# EAGLE design harp RBG array v1.0 (EAGLE 6.5.0)

## Sheet 1 of 3
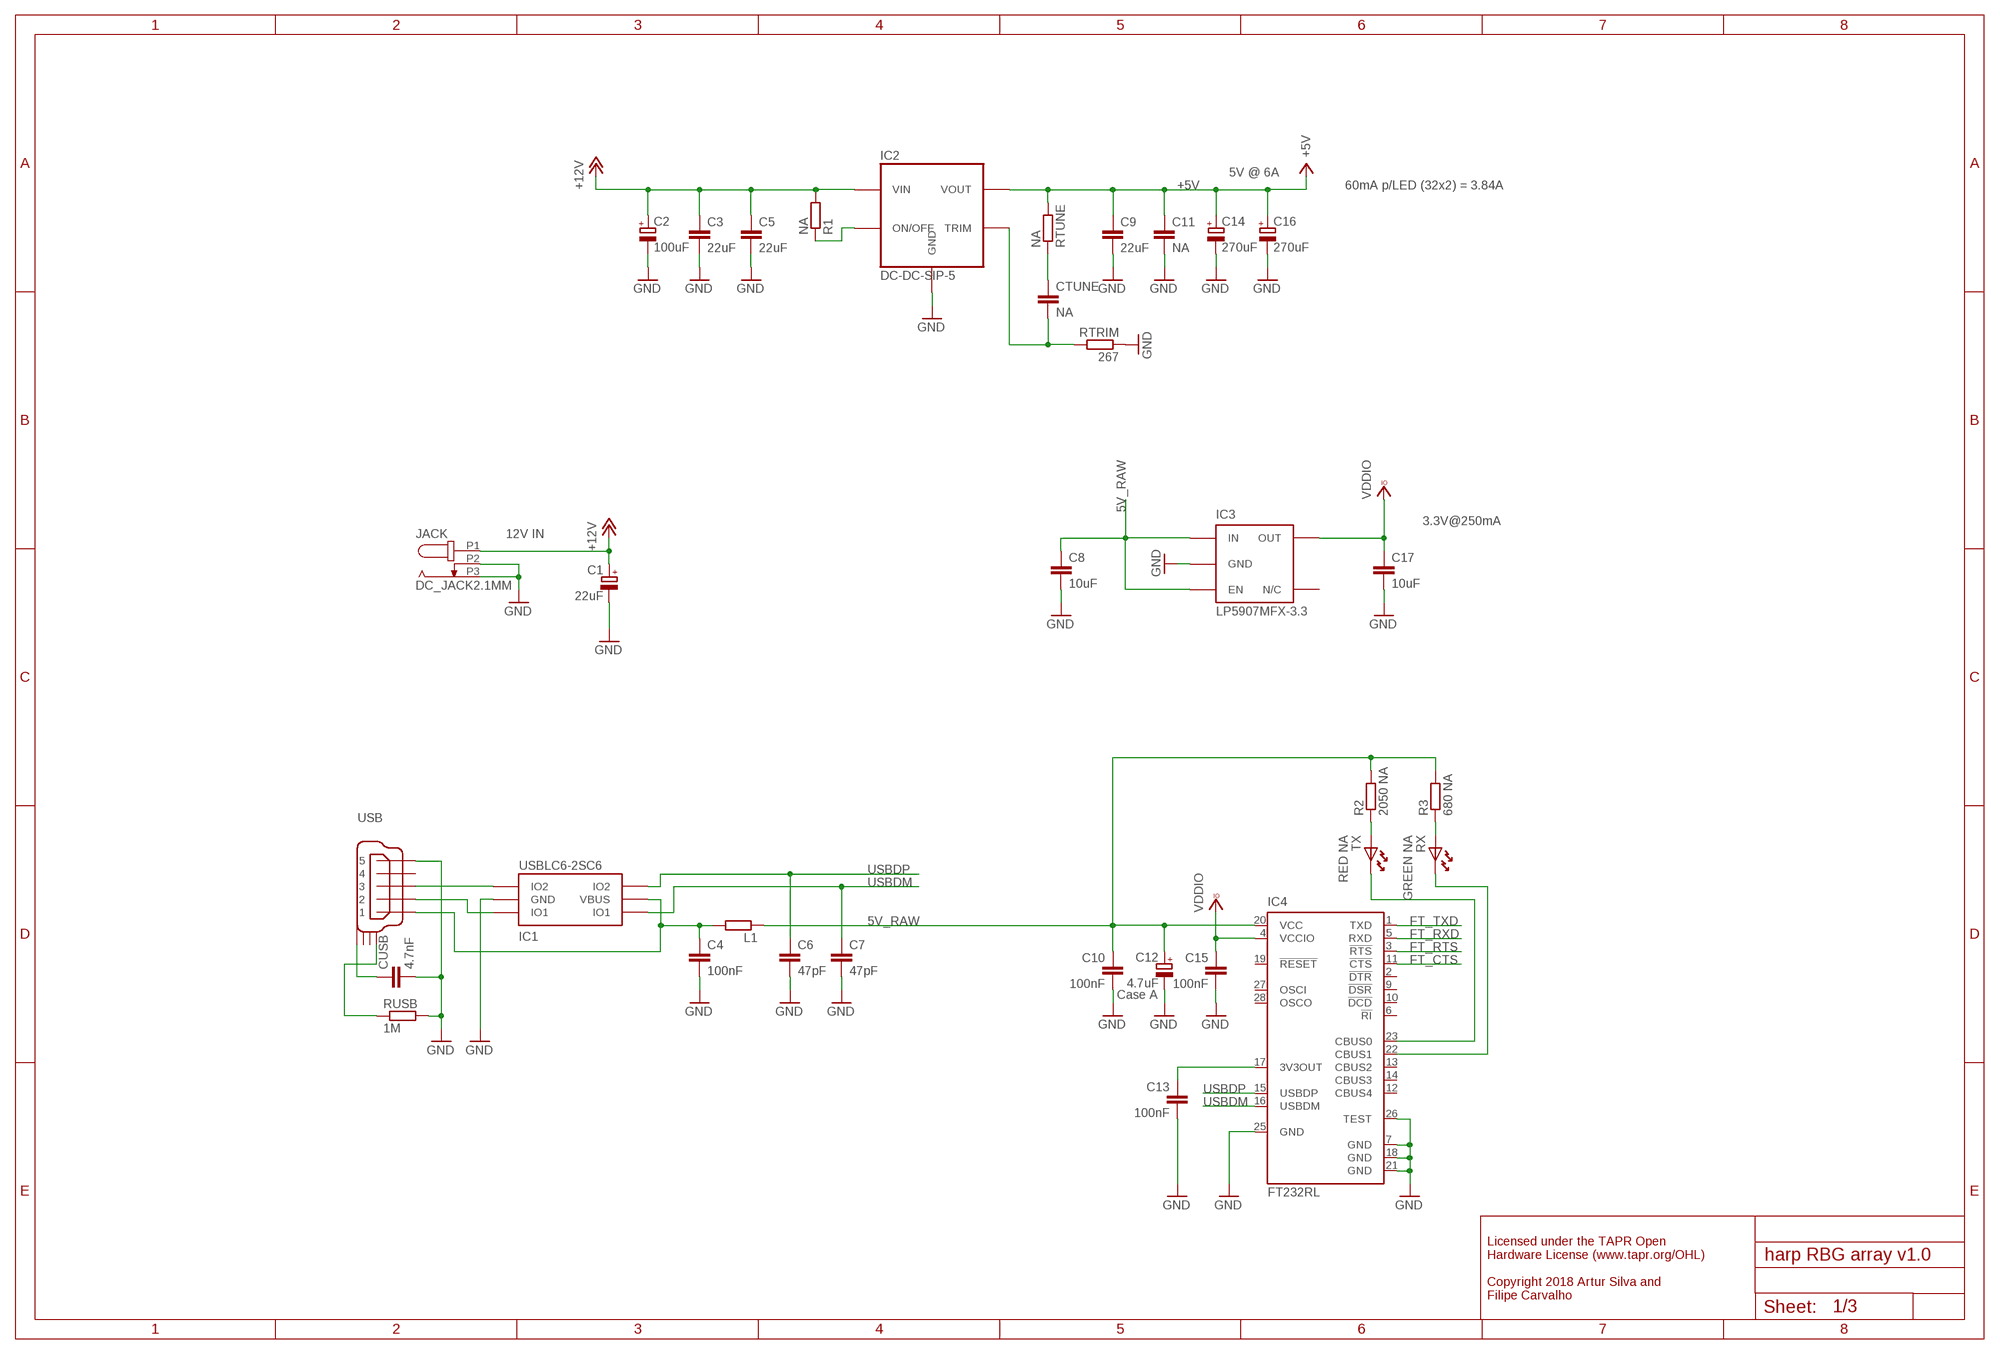
[diagram p0: schematic, sheet 1]

### Parts
C1  22uF  CAP_100UFHAND  [CAP_100UF_HAND]
C2  100uF  CPOL-EUE  [PANASONIC_E]
C3  22uF  C-EUC1210  [C1210]
C4  100nF  C-EUC0402  [C0402]
C5  22uF  C-EUC1210  [C1210]
C6  47pF  C-EUC0402  [C0402]
C7  47pF  C-EUC0402  [C0402]
C8  10uF  C-EUC0603  [C0603]
C9  22uF  C-EUC1210  [C1210]
C10  100nF  C-EUC0402  [C0402]
C11  NA  C-EUC1210  [C1210]
C12  4.7uF  CPOL-EUA/3216-18W  [A/3216-18W]
C13  100nF  C-EUC0402  [C0402]
C14  270uF  CPOL-EUE  [PANASONIC_E]
C15  100nF  C-EUC0402  [C0402]
C16  270uF  CPOL-EUE  [PANASONIC_E]
C17  10uF  C-EUC0603  [C0603]
CTUNE  NA  C-EUC0402  [C0402]
CUSB  4.7nF  C-EUC0402  [C0402]
IC1  USBLC6-2SC6  USBLC6-2  [SOT23-6L]
IC2  DC-DC-SIP-5  [SIP-5]
IC3  LP5907MFX-3.3  TLV700XX  [TSOT23-5]
IC4  FT232RL  [SSOP28]
JACK  DC_JACK2.1MM  [DC_POWER_INPUT_2.1MM]
L1  ???  R-EU_R0805  [R0805]
R1  NA  R-EU_R0402  [R0402]
R2  2050 NA  R-EU_R0402  [R0402]
R3  680 NA  R-EU_R0402  [R0402]
RTRIM  267  R-EU_R0402  [R0402]
RTUNE  NA  R-EU_R0402  [R0402]
RUSB  1M  R-EU_R0402  [R0402]
RX  GREEN NA  LEDHAND  [LED_HAND]
TX  RED NA  LEDHAND  [LED_HAND]
USB  USB_MINI_B  [240-0002-1]

### Nets
5V_RAW: C8.1 C10.1 C12.+ IC3.1(IN) IC3.3(EN) IC4.20(VCC) L1.1 R2.2 R3.2
+5V: C9.1 C11.1 C14.+ C16.+ IC2.P4(VOUT) RTUNE.2 ; also sheet 2,3
+12V: C1.+ C2.+ C3.1 C5.1 IC2.P2(VIN) JACK.P1 R1.2
FT_CTS: IC4.11(!CTS) ; also sheet 2
FT_RTS: IC4.3(!RTS) ; also sheet 2
FT_RXD: IC4.5(RXD) ; also sheet 2
FT_TXD: IC4.1(TXD) ; also sheet 2
GND: C1.- C2.- C3.2 C4.2 C5.2 C6.2 C7.2 C8.2 C9.2 C10.2 C11.2 C12.- C13.2 C14.- C15.2 C16.- C17.2 CUSB.2 IC1.P$2(GND) IC2.P3(GND) IC3.2(GND) IC4.7(GND) IC4.18(GND) IC4.21(GND) IC4.25(GND) IC4.26(TEST) JACK.P2 JACK.P3 RTRIM.1 RUSB.2 USB.P$5 ; also sheet 2,3
N$12: CTUNE.2 IC2.P5(TRIM) RTRIM.2
N$14: CTUNE.1 RTUNE.1
N$16: IC2.P1(ON/OFF) R1.1
N$38: C13.1 IC4.17(3V3OUT)
N$39: C4.1 IC1.P$5(VBUS) L1.2 USB.P$1
N$40: IC1.P$1(IO1) USB.P$2
N$47: R3.1 RX.A
N$48: IC4.23(CBUS0) TX.K
N$49: IC4.22(CBUS1) RX.K
N$50: IC1.P$3(IO2) USB.P$3
N$59: CUSB.1 USB.SHIELD_4
N$61: RUSB.1 USB.SHIELD_1
N$62: R2.1 TX.A
USBDM: C7.1 IC1.P$6(IO1) IC4.16(USBDM)
USBDP: C6.1 IC1.P$4(IO2) IC4.15(USBDP)
VCCIO: C15.1 C17.1 IC3.5(OUT) IC4.4(VCCIO) ; supply symbol labelled VDDIO ; also sheet 2,3
Unconnected: IC3.4(N/C) IC4.2(!DTR) IC4.6(!RI) IC4.9(!DSR) IC4.10(!DCD) IC4.12(CBUS4) IC4.13(CBUS2) IC4.14(CBUS3) IC4.19(!RESET) IC4.27(OSCI) IC4.28(OSCO) USB.P$4 USB.SHIELD_2 USB.SHIELD_3

### Notes on the sheet
- 5V @ 6A
- 60mA p/LED (32x2) = 3.84A
- 3.3V@250mA
- 12V IN
- Case A
- Licensed under the TAPR Open
  Hardware License (www.tapr.org/OHL)
  
  Copyright 2018 Artur Silva and 
  Filipe Carvalho

## Sheet 2 of 3
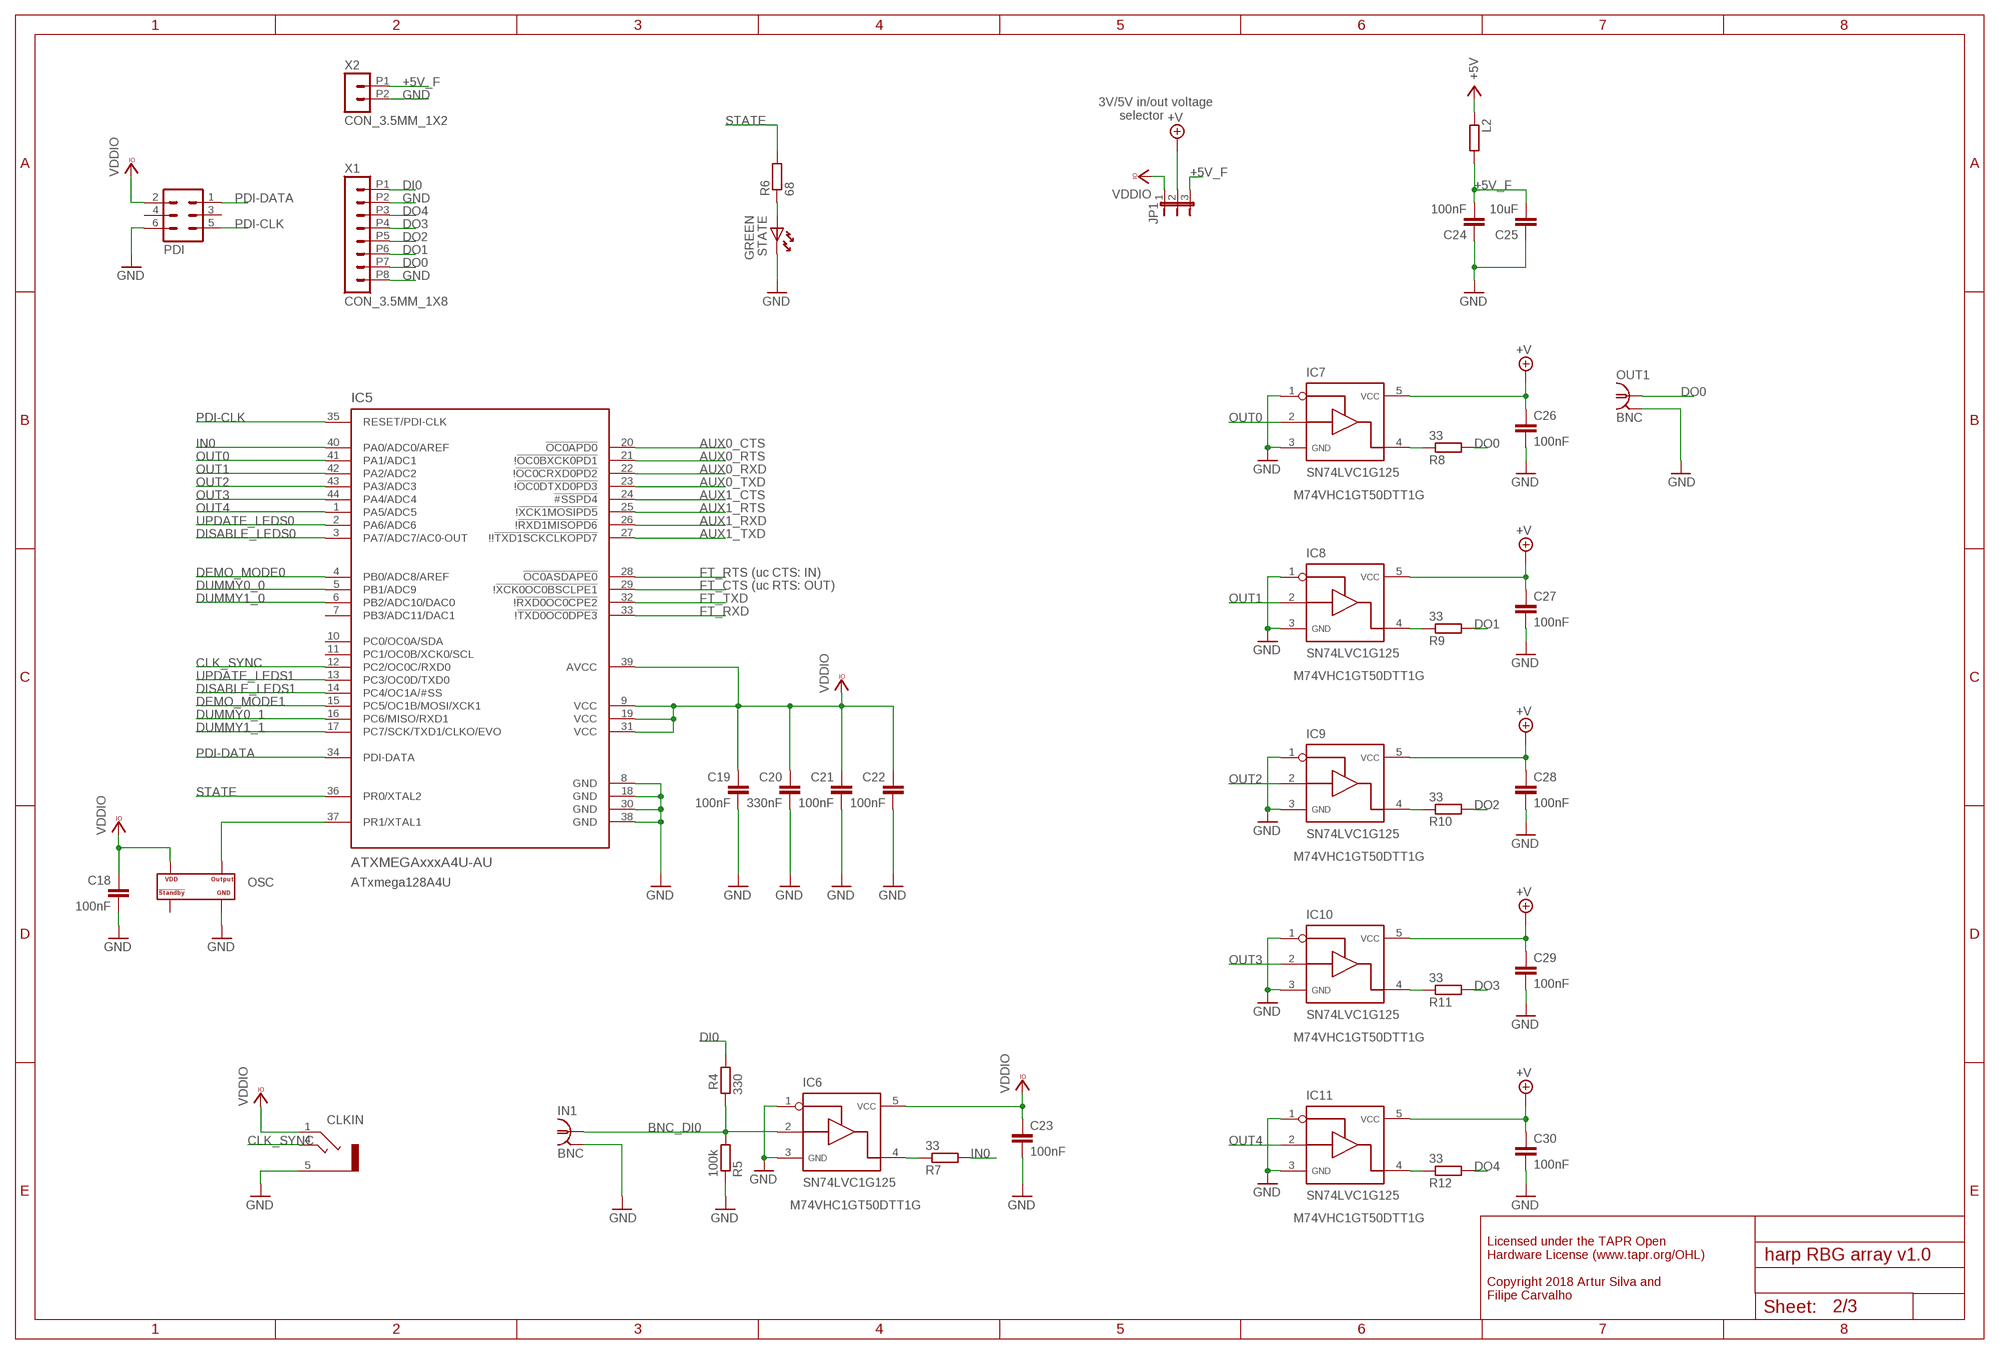
[diagram p1: schematic, sheet 2]

### Parts
C18  100nF  C-EUC0402  [C0402]
C19  100nF  C-EUC0402  [C0402]
C20  330nF  C-EUC0402  [C0402]
C21  100nF  C-EUC0402  [C0402]
C22  100nF  C-EUC0402  [C0402]
C23  100nF  C-EUC0402  [C0402]
C24  100nF  C-EUC0402  [C0402]
C25  10uF  C-EUC0603  [C0603]
C26  100nF  C-EUC0402  [C0402]
C27  100nF  C-EUC0402  [C0402]
C28  100nF  C-EUC0402  [C0402]
C29  100nF  C-EUC0402  [C0402]
C30  100nF  C-EUC0402  [C0402]
CLKIN  STEREO_JACK  [35RASMT2BHNTRX]
IC5  ATXMEGAxxxA4U-AU  AT-XMEGA-XXA4-AU  [QFP80P1200X1200X120-44N]
IC6  SN74LVC1G125  [SOT23-5]
IC7  SN74LVC1G125  [SOT23-5]
IC8  SN74LVC1G125  [SOT23-5]
IC9  SN74LVC1G125  [SOT23-5]
IC10  SN74LVC1G125  [SOT23-5]
IC11  SN74LVC1G125  [SOT23-5]
IN1  BNC  [BNC_RA]
JP1  JP2E  [JP2]
L2  600@100M  R-EU_R0805  [R0805]
OSC  OSCILLATOR  [OSCILLATOR_3.2X2.5]
OUT1  BNC  [BNC_RA]
PDI  MA03-2  [MA03-2]
R4  330  R-EU_R0402  [R0402]
R5  100k  R-EU_R0402  [R0402]
R6  68  R-EU_R0402  [R0402]
R7  33  R-EU_R0402  [R0402]
R8  33  R-EU_R0402  [R0402]
R9  33  R-EU_R0402  [R0402]
R10  33  R-EU_R0402  [R0402]
R11  33  R-EU_R0402  [R0402]
R12  33  R-EU_R0402  [R0402]
STATE  GREEN  LEDHAND  [LED_HAND]
X1  CON_3.5MM_1X8  [CON_3.5MM_1X8]
X2  CON_3.5MM_1X2  [CON_3.5MM_1X2]

### Nets
+5V: L2.1 ; also sheet 1,3
+5V_F: C24.2 C25.2 JP1.3 L2.2 X2.P1
+V: C26.1 C27.1 C28.1 C29.1 C30.1 IC7.5 IC8.5 IC9.5 IC10.5 IC11.5 JP1.2
AUX0_CTS: IC5.20(!OC0APD0) ; also sheet 3
AUX0_RTS: IC5.21(!!OC0BXCK0PD1) ; also sheet 3
AUX0_RXD: IC5.22(!!OC0CRXD0PD2) ; also sheet 3
AUX0_TXD: IC5.23(!!OC0DTXD0PD3) ; also sheet 3
AUX1_CTS: IC5.24(!#SSPD4) ; also sheet 3
AUX1_RTS: IC5.25(!!XCK1MOSIPD5) ; also sheet 3
AUX1_RXD: IC5.26(!!RXD1MISOPD6) ; also sheet 3
AUX1_TXD: IC5.27(!!!TXD1SCKCLKOPD7) ; also sheet 3
BNC_DI0: IC6.2 IN1.1 R4.2 R5.2
CLK_SYNC: CLKIN.4 IC5.12(PC2/OC0C/RXD0)
DEMO_MODE0: IC5.4(PB0/ADC8/AREF) ; also sheet 3
DEMO_MODE1: IC5.15(PC5/OC1B/MOSI/XCK1) ; also sheet 3
DI0: R4.1 X1.P1
DISABLE_LEDS0: IC5.3(PA7/ADC7/AC0-OUT) ; also sheet 3
DISABLE_LEDS1: IC5.14(PC4/OC1A/#SS) ; also sheet 3
DO0: OUT1.1 R8.2 X1.P7
DO1: R9.2 X1.P6
DO2: R10.2 X1.P5
DO3: R11.2 X1.P4
DO4: R12.2 X1.P3
DUMMY0_0: IC5.5(PB1/ADC9) ; also sheet 3
DUMMY0_1: IC5.16(PC6/MISO/RXD1) ; also sheet 3
DUMMY1_0: IC5.6(PB2/ADC10/DAC0) ; also sheet 3
DUMMY1_1: IC5.17(PC7/SCK/TXD1/CLKO/EVO) ; also sheet 3
FT_CTS: IC5.29(!!XCK0OC0BSCLPE1) ; also sheet 1
FT_RTS: IC5.28(!OC0ASDAPE0) ; also sheet 1
FT_RXD: IC5.33(!!TXD0OC0DPE3) ; also sheet 1
FT_TXD: IC5.32(!!RXD0OC0CPE2) ; also sheet 1
GND: C18.2 C19.2 C20.2 C21.2 C22.2 C23.2 C24.1 C25.1 C26.2 C27.2 C28.2 C29.2 C30.2 CLKIN.5 IC5.8(GND) IC5.18(GND) IC5.30(GND) IC5.38(GND) IC6.1 IC6.3 IC7.1 IC7.3 IC8.1 IC8.3 IC9.1 IC9.3 IC10.1 IC10.3 IC11.1 IC11.3 IN1.2 OSC.P$2(GND) OUT1.2 PDI.6 R5.1 STATE.K X1.P2 X1.P8 X2.P2 ; also sheet 1,3
IN0: IC5.40(PA0/ADC0/AREF) R7.2
N$2: IC6.4 R7.1
N$3: IC8.4 R9.1
N$4: IC7.4 R8.1
N$5: IC9.4 R10.1
N$6: IC10.4 R11.1
N$7: IC11.4 R12.1
N$23: R6.1 STATE.A
OSC2: IC5.37(PR1/XTAL1) OSC.P$3(OUTPUT)
OUT0: IC5.41(PA1/ADC1) IC7.2
OUT1: IC5.42(PA2/ADC2) IC8.2
OUT2: IC5.43(PA3/ADC3) IC9.2
OUT3: IC5.44(PA4/ADC4) IC10.2
OUT4: IC5.1(PA5/ADC5) IC11.2
PDI-CLK: IC5.35(RESET/PDI-CLK) PDI.5
PDI-DATA: IC5.34(PDI-DATA) PDI.1
STATE: IC5.36(PR0/XTAL2) R6.2
UPDATE_LEDS0: IC5.2(PA6/ADC6) ; also sheet 3
UPDATE_LEDS1: IC5.13(PC3/OC0D/TXD0) ; also sheet 3
VCCIO: C18.1 C19.1 C20.1 C21.1 C22.1 C23.1 CLKIN.1 IC5.9(VCC) IC5.19(VCC) IC5.31(VCC) IC5.39(AVCC) IC6.5 JP1.1 OSC.P$4(VDD) PDI.2 ; supply symbol labelled VDDIO ; also sheet 1,3
Unconnected: IC5.7(PB3/ADC11/DAC1) IC5.10(PC0/OC0A/SDA) IC5.11(PC1/OC0B/XCK0/SCL) OSC.P$1(STANDBY#) PDI.3 PDI.4

### Notes on the sheet
- 3V/5V in/out voltage
        selector
- M74VHC1GT50DTT1G
- (uc CTS: IN)
- (uc RTS: OUT)
- M74VHC1GT50DTT1G
- M74VHC1GT50DTT1G
- ATxmega128A4U
- M74VHC1GT50DTT1G
- M74VHC1GT50DTT1G
- M74VHC1GT50DTT1G
- Licensed under the TAPR Open
  Hardware License (www.tapr.org/OHL)
  
  Copyright 2018 Artur Silva and 
  Filipe Carvalho

## Sheet 3 of 3
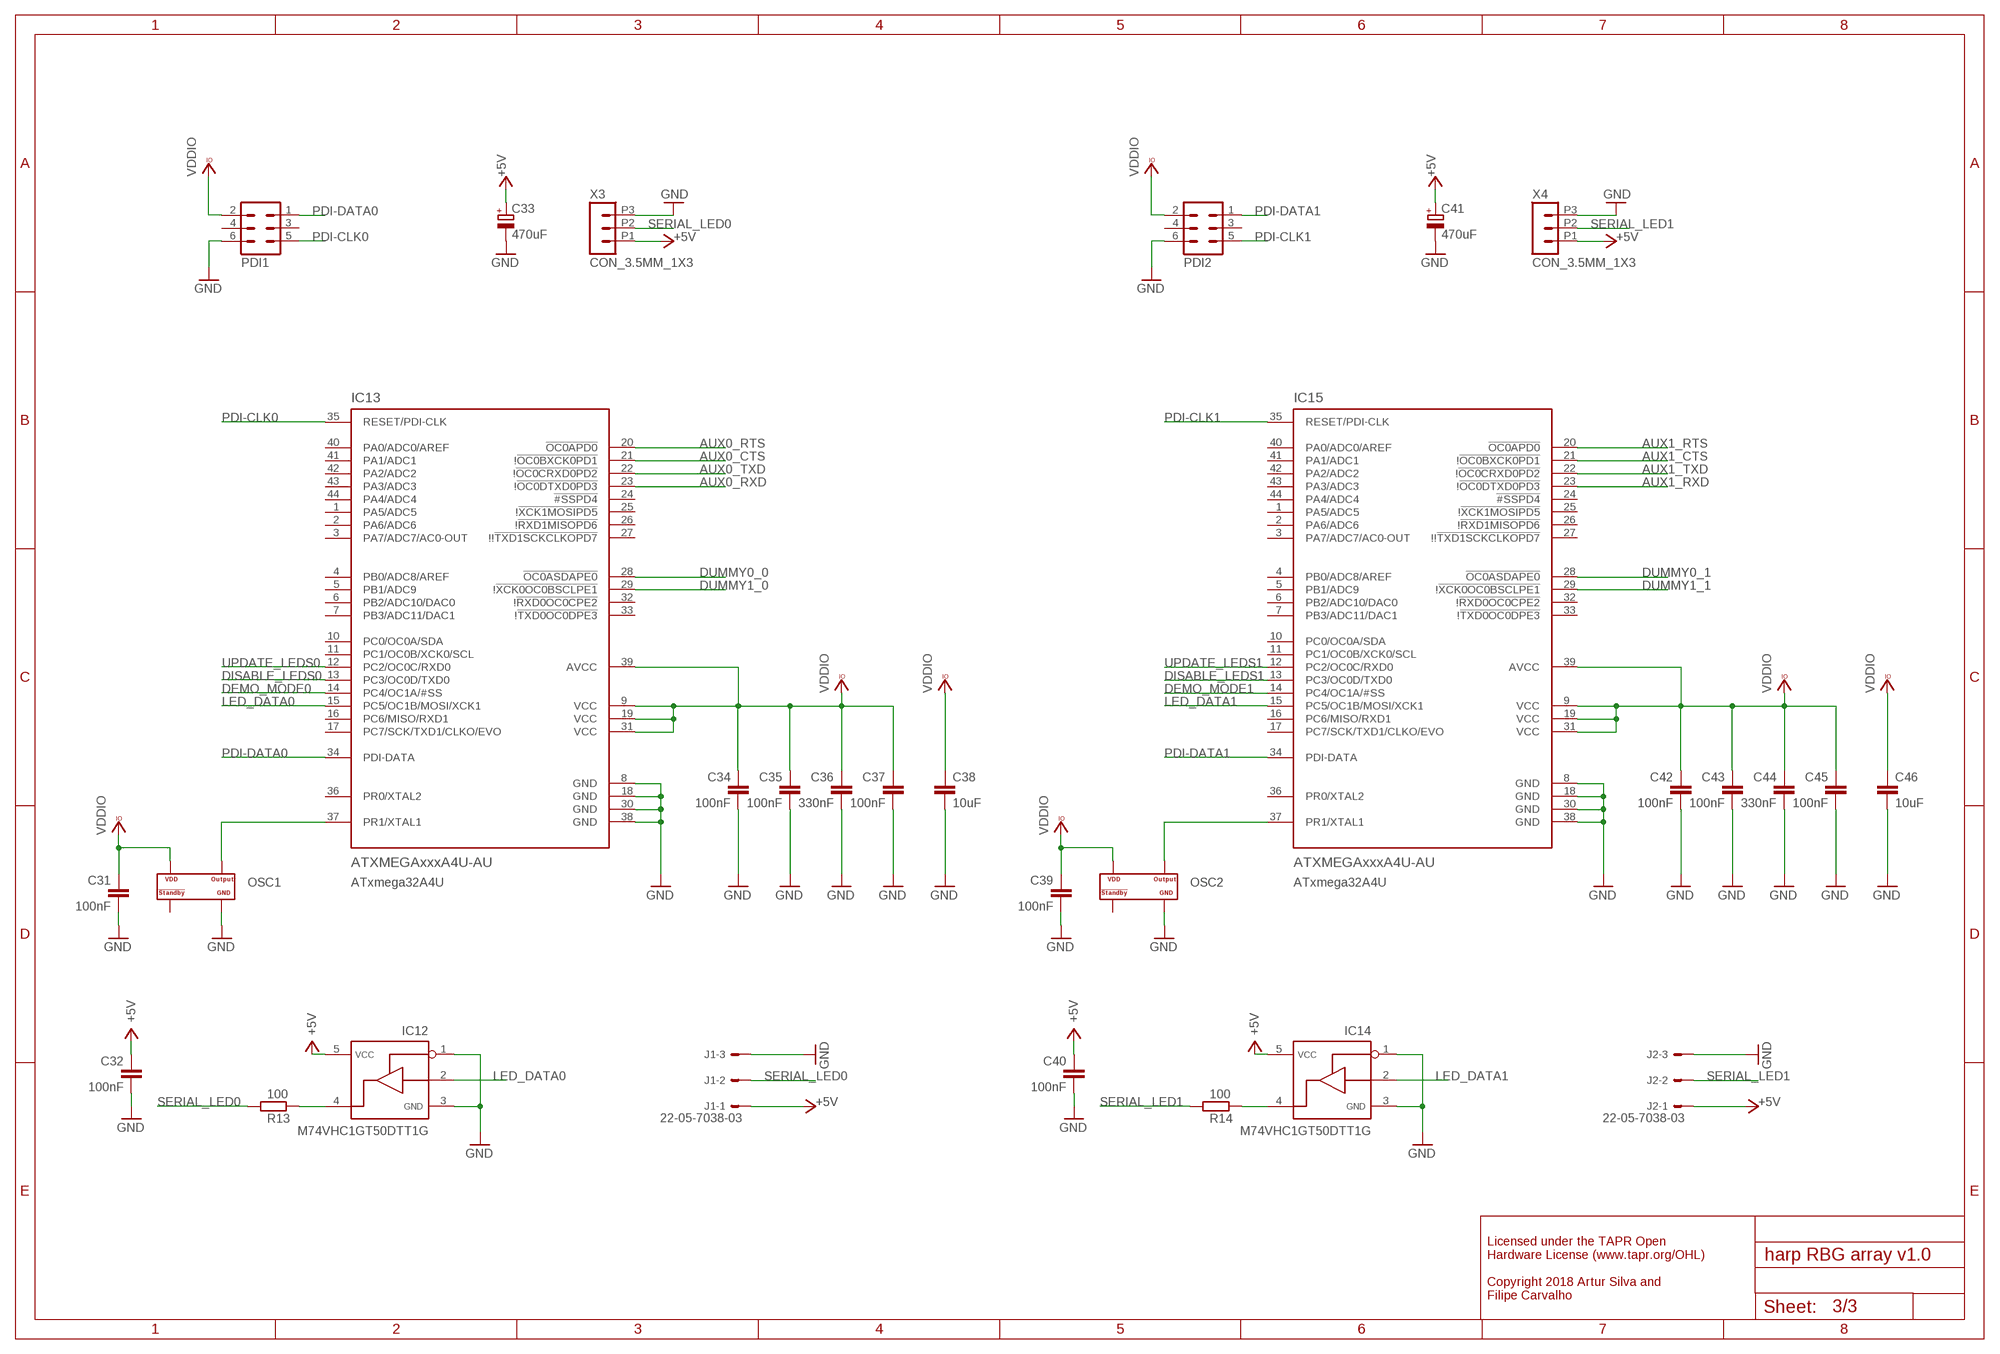
[diagram p2: schematic, sheet 3]

### Parts
C31  100nF  C-EUC0402  [C0402]
C32  100nF  C-EUC0402  [C0402]
C33  470uF  CPOL-EUE3.5-8  [E3,5-8]
C34  100nF  C-EUC0402  [C0402]
C35  100nF  C-EUC0402  [C0402]
C36  330nF  C-EUC0402  [C0402]
C37  100nF  C-EUC0402  [C0402]
C38  10uF  C-EUC0603  [C0603]
C39  100nF  C-EUC0402  [C0402]
C40  100nF  C-EUC0402  [C0402]
C41  470uF  CPOL-EUE3.5-8  [E3,5-8]
C42  100nF  C-EUC0402  [C0402]
C43  100nF  C-EUC0402  [C0402]
C44  330nF  C-EUC0402  [C0402]
C45  100nF  C-EUC0402  [C0402]
C46  10uF  C-EUC0603  [C0603]
IC12  M74VHC1GT50DTT1G  SN74LVC1G125  [SOT23-5]
IC13  ATXMEGAxxxA4U-AU  AT-XMEGA-XXA4-AU  [QFP80P1200X1200X120-44N]
IC14  M74VHC1GT50DTT1G  SN74LVC1G125  [SOT23-5]
IC15  ATXMEGAxxxA4U-AU  AT-XMEGA-XXA4-AU  [QFP80P1200X1200X120-44N]
J1  22-05-7038-03  [7395-03]
J2  22-05-7038-03  [7395-03]
OSC1  OSCILLATOR  [OSCILLATOR_3.2X2.5]
OSC2  OSCILLATOR  [OSCILLATOR_3.2X2.5]
PDI1  MA03-2  [MA03-2]
PDI2  MA03-2  [MA03-2]
R13  100  R-EU_R0402  [R0402]
R14  100  R-EU_R0402  [R0402]
X3  CON_3.5MM_1X3  [CON_3.5MM_1X3]
X4  CON_3.5MM_1X3  [CON_3.5MM_1X3]

### Nets
+5V: C32.1 C33.+ C40.1 C41.+ IC12.5 IC14.5 J1.1 J2.1 X3.P1 X4.P1 ; also sheet 1,2
AUX0_CTS: IC13.21(!!OC0BXCK0PD1) ; also sheet 2
AUX0_RTS: IC13.20(!OC0APD0) ; also sheet 2
AUX0_RXD: IC13.23(!!OC0DTXD0PD3) ; also sheet 2
AUX0_TXD: IC13.22(!!OC0CRXD0PD2) ; also sheet 2
AUX1_CTS: IC15.21(!!OC0BXCK0PD1) ; also sheet 2
AUX1_RTS: IC15.20(!OC0APD0) ; also sheet 2
AUX1_RXD: IC15.23(!!OC0DTXD0PD3) ; also sheet 2
AUX1_TXD: IC15.22(!!OC0CRXD0PD2) ; also sheet 2
DEMO_MODE0: IC13.14(PC4/OC1A/#SS) ; also sheet 2
DEMO_MODE1: IC15.14(PC4/OC1A/#SS) ; also sheet 2
DISABLE_LEDS0: IC13.13(PC3/OC0D/TXD0) ; also sheet 2
DISABLE_LEDS1: IC15.13(PC3/OC0D/TXD0) ; also sheet 2
DUMMY0_0: IC13.28(!OC0ASDAPE0) ; also sheet 2
DUMMY0_1: IC15.28(!OC0ASDAPE0) ; also sheet 2
DUMMY1_0: IC13.29(!!XCK0OC0BSCLPE1) ; also sheet 2
DUMMY1_1: IC15.29(!!XCK0OC0BSCLPE1) ; also sheet 2
GND: C31.2 C32.2 C33.- C34.2 C35.2 C36.2 C37.2 C38.2 C39.2 C40.2 C41.- C42.2 C43.2 C44.2 C45.2 C46.2 IC12.1 IC12.3 IC13.8(GND) IC13.18(GND) IC13.30(GND) IC13.38(GND) IC14.1 IC14.3 IC15.8(GND) IC15.18(GND) IC15.30(GND) IC15.38(GND) J1.3 J2.3 OSC1.P$2(GND) OSC2.P$2(GND) PDI1.6 PDI2.6 X3.P3 X4.P3 ; also sheet 1,2
LED_DATA0: IC12.2 IC13.15(PC5/OC1B/MOSI/XCK1)
LED_DATA1: IC14.2 IC15.15(PC5/OC1B/MOSI/XCK1)
N$1: IC14.4 R14.2
N$13: IC12.4 R13.2
OSC1: IC13.37(PR1/XTAL1) OSC1.P$3(OUTPUT)
OSC3: IC15.37(PR1/XTAL1) OSC2.P$3(OUTPUT)
PDI-CLK0: IC13.35(RESET/PDI-CLK) PDI1.5
PDI-CLK1: IC15.35(RESET/PDI-CLK) PDI2.5
PDI-DATA0: IC13.34(PDI-DATA) PDI1.1
PDI-DATA1: IC15.34(PDI-DATA) PDI2.1
SERIAL_LED0: J1.2 R13.1 X3.P2
SERIAL_LED1: J2.2 R14.1 X4.P2
UPDATE_LEDS0: IC13.12(PC2/OC0C/RXD0) ; also sheet 2
UPDATE_LEDS1: IC15.12(PC2/OC0C/RXD0) ; also sheet 2
VCCIO: C31.1 C34.1 C35.1 C36.1 C37.1 C38.1 C39.1 C42.1 C43.1 C44.1 C45.1 C46.1 IC13.9(VCC) IC13.19(VCC) IC13.31(VCC) IC13.39(AVCC) IC15.9(VCC) IC15.19(VCC) IC15.31(VCC) IC15.39(AVCC) OSC1.P$4(VDD) OSC2.P$4(VDD) PDI1.2 PDI2.2 ; supply symbol labelled VDDIO ; also sheet 1,2
Unconnected: IC13.1(PA5/ADC5) IC13.2(PA6/ADC6) IC13.3(PA7/ADC7/AC0-OUT) IC13.4(PB0/ADC8/AREF) IC13.5(PB1/ADC9) IC13.6(PB2/ADC10/DAC0) IC13.7(PB3/ADC11/DAC1) IC13.10(PC0/OC0A/SDA) IC13.11(PC1/OC0B/XCK0/SCL) IC13.16(PC6/MISO/RXD1) IC13.17(PC7/SCK/TXD1/CLKO/EVO) IC13.24(!#SSPD4) IC13.25(!!XCK1MOSIPD5) IC13.26(!!RXD1MISOPD6) IC13.27(!!!TXD1SCKCLKOPD7) IC13.32(!!RXD0OC0CPE2) IC13.33(!!TXD0OC0DPE3) IC13.36(PR0/XTAL2) IC13.40(PA0/ADC0/AREF) IC13.41(PA1/ADC1) IC13.42(PA2/ADC2) IC13.43(PA3/ADC3) IC13.44(PA4/ADC4) IC15.1(PA5/ADC5) IC15.2(PA6/ADC6) IC15.3(PA7/ADC7/AC0-OUT) IC15.4(PB0/ADC8/AREF) IC15.5(PB1/ADC9) IC15.6(PB2/ADC10/DAC0) IC15.7(PB3/ADC11/DAC1) IC15.10(PC0/OC0A/SDA) IC15.11(PC1/OC0B/XCK0/SCL) IC15.16(PC6/MISO/RXD1) IC15.17(PC7/SCK/TXD1/CLKO/EVO) IC15.24(!#SSPD4) IC15.25(!!XCK1MOSIPD5) IC15.26(!!RXD1MISOPD6) IC15.27(!!!TXD1SCKCLKOPD7) IC15.32(!!RXD0OC0CPE2) IC15.33(!!TXD0OC0DPE3) IC15.36(PR0/XTAL2) IC15.40(PA0/ADC0/AREF) IC15.41(PA1/ADC1) IC15.42(PA2/ADC2) IC15.43(PA3/ADC3) IC15.44(PA4/ADC4) OSC1.P$1(STANDBY#) OSC2.P$1(STANDBY#) PDI1.3 PDI1.4 PDI2.3 PDI2.4

### Notes on the sheet
- ATxmega32A4U | ATxmega32A4U
- Licensed under the TAPR Open
  Hardware License (www.tapr.org/OHL)
  
  Copyright 2018 Artur Silva and 
  Filipe Carvalho

## Library data of the parts
C1 = CNP-miscellaneous:CAP_100UF
C2 C12 C14 C16 = rcl:CPOL-EU: POLARIZED CAPACITOR, European symbol
C3-C11 C13 C15 C17-C32 C34-C40 C42-C46 CTUNE CUSB = rcl:C-EU: CAPACITOR, European symbol
C33 C41 = resistor:CPOL-EU: POLARIZED CAPACITOR, European symbol
CLKIN = CNP-connectors:STEREO_JACK
IC1 = CNP 2:USBLC6-2
IC2 = CNP-connectors:DC-DC-SIP-5
IC3 = CNP:TLV700XX
IC4 = ftdichip:FT232R: Source: http://www.ftdichip.com/Documents/DataSheets/DS_FT232R_v104.pdf; MPN: FT232RL; OC_FARNELL: 1146032; OC_NEWARK: 91K9918
IC5 IC13 IC15 = xmega-a4:AT-XMEGA-XXA4-AU: ATxMega a4 Serie
IC6-IC12 IC14 = My_library 0v2:SN74LVC1G125
IN1 OUT1 = CNP-connectors:BNC
J1 J2 = con-molex:22-?-03: CONNECTOR wire to board 2.54 mm (.1 inch) pitch header; OC_FARNELL: unknown; OC_NEWARK: unknown
JACK = CNP-miscellaneous:DC_JACK
JP1 = jumper:JP2E: JUMPER
L1 L2 R1-R14 RTRIM RTUNE RUSB = rcl:R-EU_: RESISTOR, European symbol
OSC OSC1 OSC2 = CNP-miscellaneous:OSCILLATOR
PDI PDI1 PDI2 = con-lstb:MA03-2: PIN HEADER; OC_FARNELL: unknown; OC_NEWARK: unknown
RX STATE TX = CNP-miscellaneous:LED
USB = CNP-connectors:USB_MINI_B
X1 = CNP-connectors:CON_3.5MM_1X8
X2 = CNP-connectors:CON_3.5MM_1X2
X3 X4 = CNP-connectors:CON_3.5MM_1X3

## Board
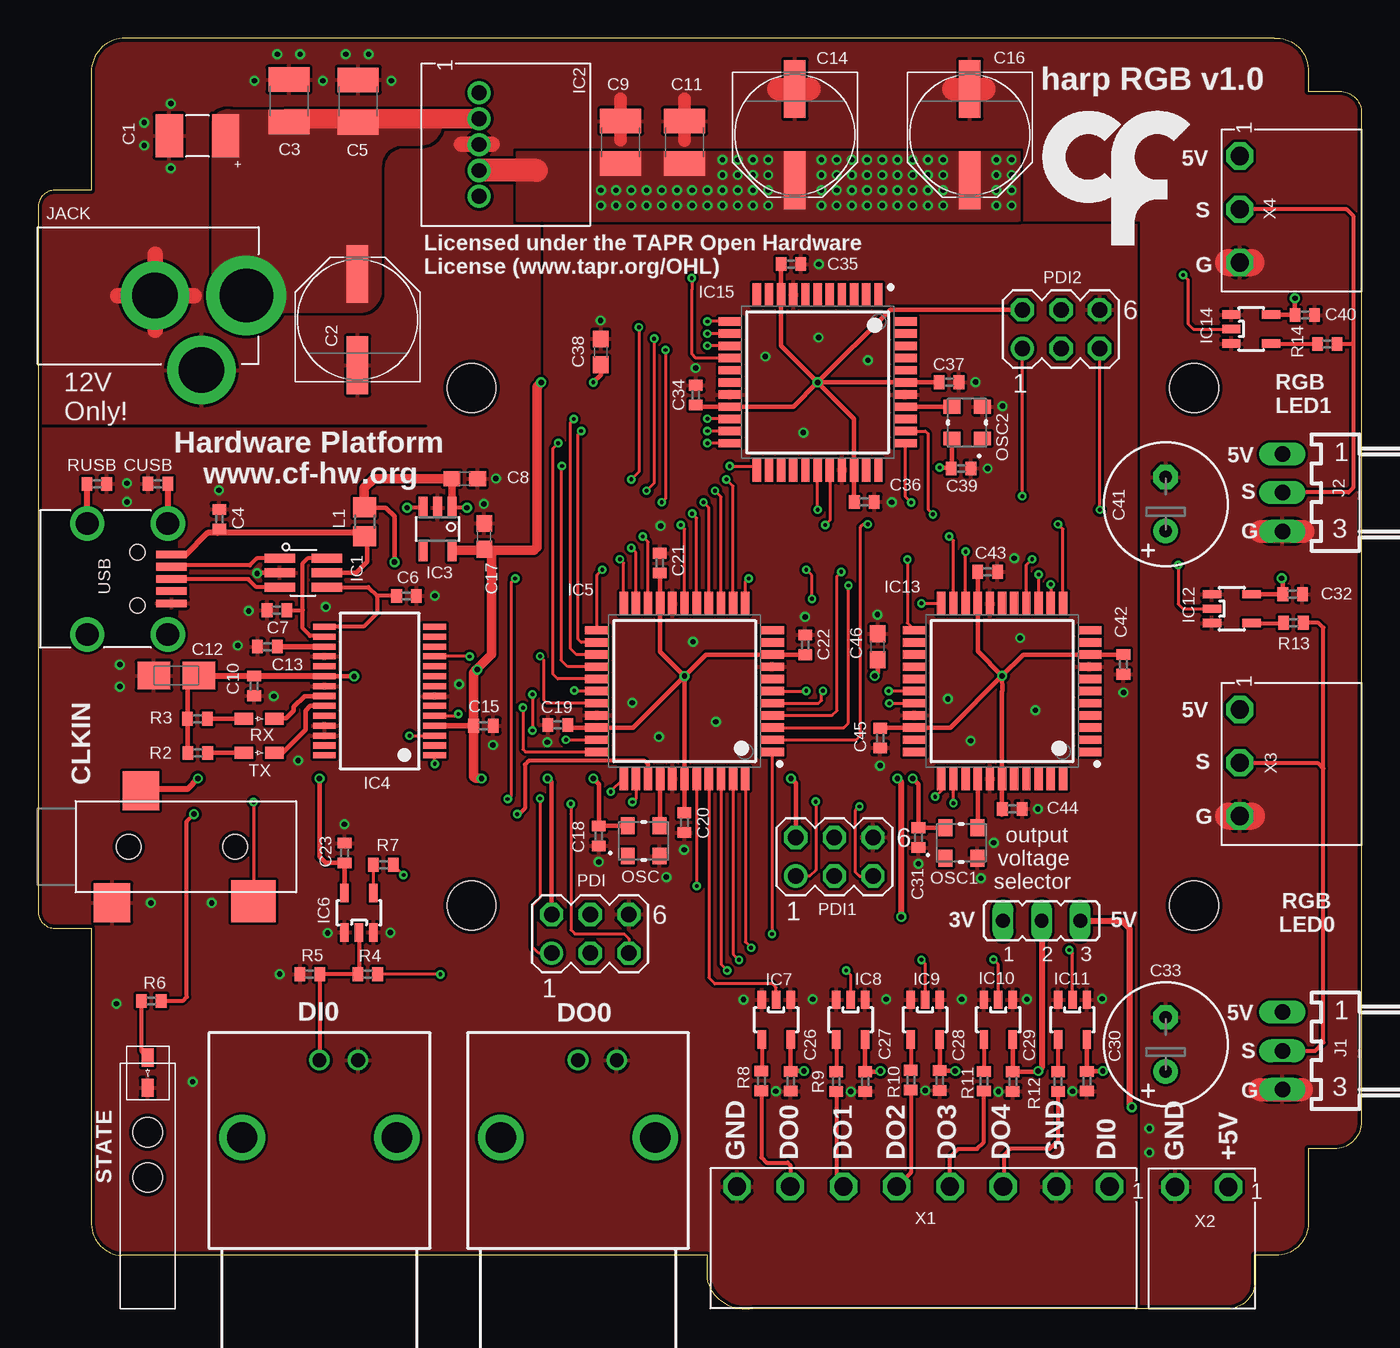
[diagram p3: board, top side]
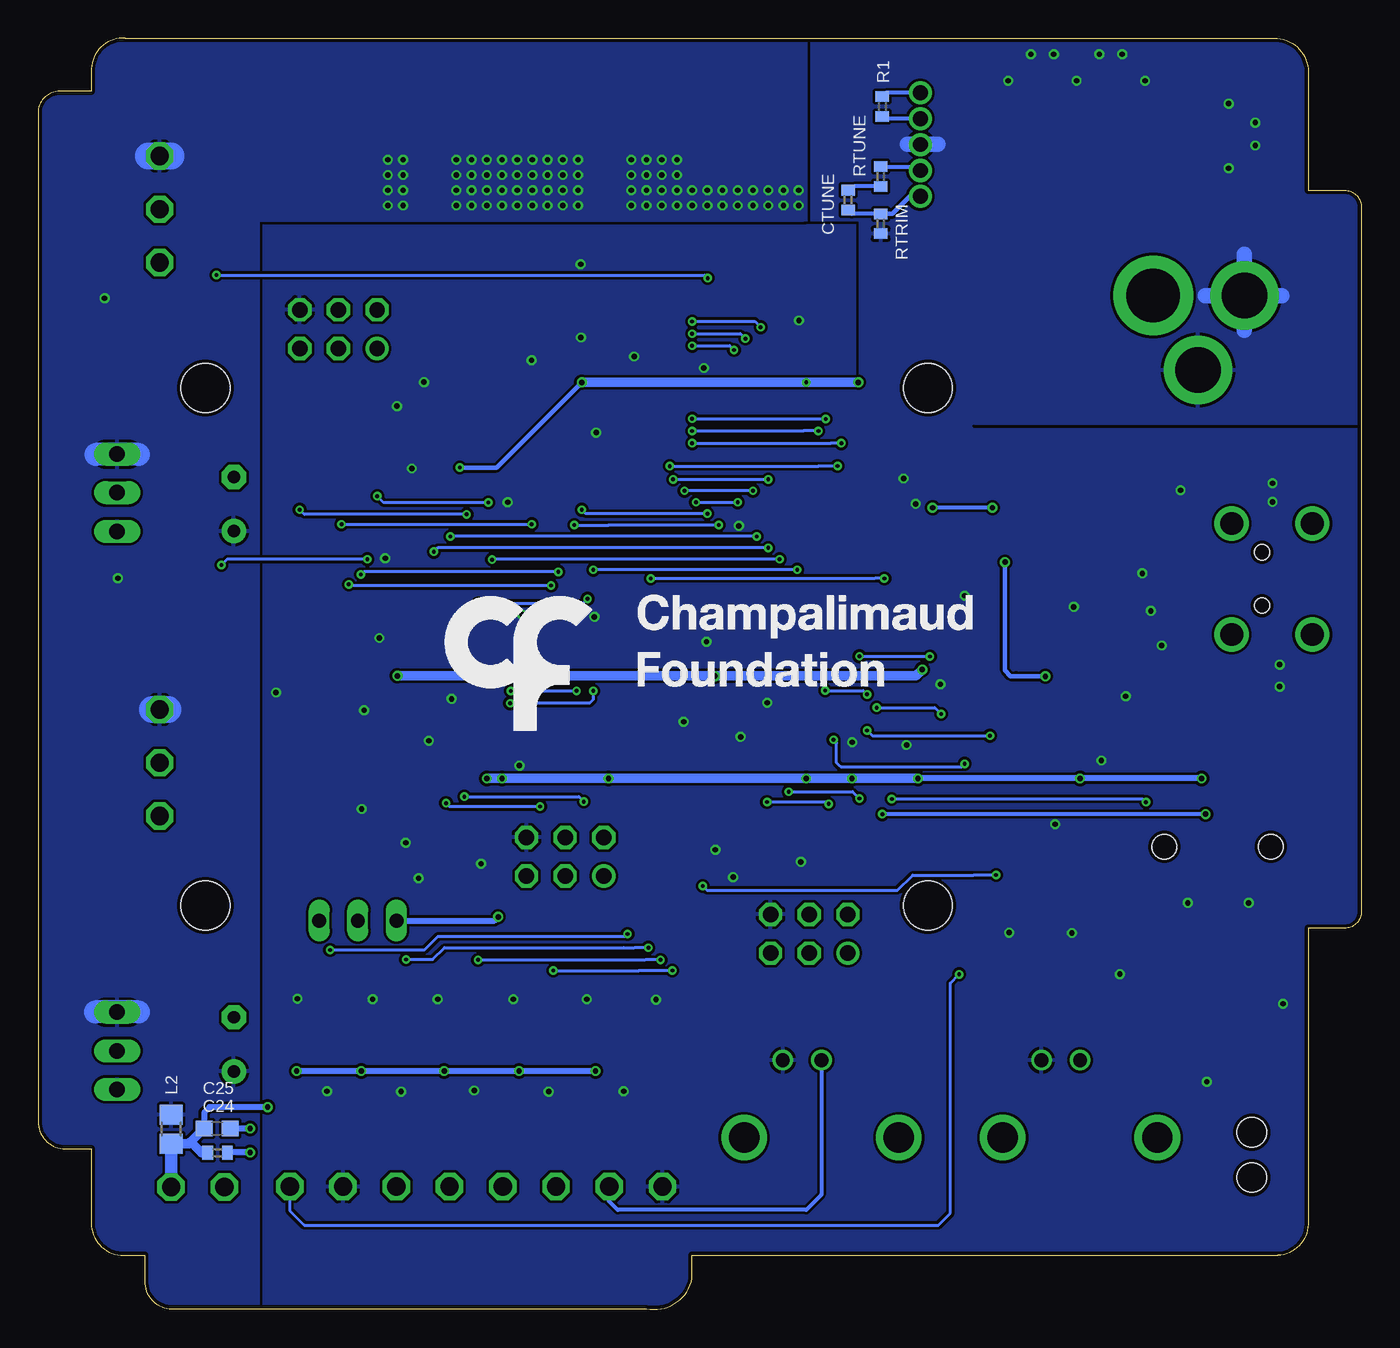
[diagram p4: board, bottom side, seen from below]

Size 87 x 83.55 mm. Coordinates in mm from the lower left corner, seen from the top.
Outline: 3.5,81.31 3.5,73.55 1.12,73.55 arc90 0,72.43 0,26.17 arc90 1.12,25.05 3.5,25.05 3.5,5.79 arc90 5.5,3.55 44,3.55 44,2.04 arc90 46.99,0.05 78.2,0.05 arc90 80,1.85 80,3.55 81.39,3.55 arc90 83.5,5.66 83.5,10.55 85.2,10.55 arc90 87,12.35 87,78.64 arc90 85.59,80.05 83.5,80.05 83.5,81.55 arc90 81.26,83.55 5.74,83.55 arc90 3.5,81.31
Copper layers (1*16): Top 0.018mm / dielectric 1.55mm / Bottom 0.018mm
Design rules "eC_2Layer_PClass6_BaseCopperO18_eCDefault *": minimum track width 0.15mm, minimum drill 0.25mm, track to track 0.175mm, track to pad 0.175mm, pad to pad 0.175mm, via to via 0.175mm, smd to smd 0mil, copper to edge 0.25mm, drill to drill 0.35mm, minimum pad ring 0.125mm, minimum via ring 0.125mm, stop-mask expansion 0mil, vias tented up to drill 0.45mm, thermal gap 0.2mm
Holes 3.2 mm at 28.5,60.55 28.5,26.55 76,60.55 76,26.55
tRestrict: 4 lines
bRestrict: 3 lines

### Footprints (pad centres in the part's own frame; a part is rotated, then mirrored left to right if it is on the bottom)
CAP_100UF_HAND = smd 1.8 x 2.8: + -1.85,0; - 1.85,0
PANASONIC_E = smd 3.8 x 1.4: + 3,0; - -3,0
C1210 = smd 1.6 x 2.7: 1 -1.4,0; 2 1.4,0
C0402 = smd 0.7 x 0.9: 1 -0.65,0; 2 0.65,0
C0603 = smd 1.1 x 1: 1 -0.85,0; 2 0.85,0
A/3216-18W = smd 2.15 x 1.8: + 1.475,0; - -1.475,0
E3,5-8 = drill 0.813 pad 1.6: + -1.778,0 | drill 0.813 pad 1.6 octagon: - 1.778,0
35RASMT2BHNTRX = smd 2.4 x 2.55: 1 0.8,3.675; 5 -1.1,-3.675 | smd 2.9 x 2.75: 4 8.2,-3.575 | hole 1.6: 0,0; 7,0
SOT23-6L = smd 0.6 x 2: P$1 -0.95,-1.55; P$2 0,-1.55; P$3 0.95,-1.55; P$4 0.95,1.55; P$5 0,1.55; P$6 -0.95,1.55
SIP-5 = drill 0.97 pad 1.52: P1 -3.4,0; P2 -1.7,0; P3 0,0; P4 1.7,0; P5 3.4,0
TSOT23-5 = smd 0.6 x 1.408: 1 -0.95,-1.404; 2 0,-1.404; 3 0.95,-1.404; 4 0.95,1.404; 5 -0.95,1.404
SSOP28 = smd 0.4 x 1.5: 1 -4.225,-3.625; 2 -3.575,-3.625; 3 -2.925,-3.625; 4 -2.275,-3.625; 5 -1.625,-3.625; 6 -0.975,-3.625; 7 -0.325,-3.625; 8 0.325,-3.625; 9 0.975,-3.625; 10 1.625,-3.625; 11 2.275,-3.625; 12 2.925,-3.625; 13 3.575,-3.625; 14 4.225,-3.625; 15 4.225,3.625; 16 3.575,3.625; 17 2.925,3.625; 18 2.275,3.625; 19 1.625,3.625; 20 0.975,3.625; 21 0.325,3.625; 22 -0.325,3.625; 23 -0.975,3.625; 24 -1.625,3.625; 25 -2.275,3.625; 26 -2.925,3.625; 27 -3.575,3.625; 28 -4.225,3.625
QFP80P1200X1200X120-44N = smd 1.55 x 0.55: 1 -5.75,4; 2 -5.75,3.2; 3 -5.75,2.4; 4 -5.75,1.6; 5 -5.75,0.8; 6 -5.75,0; 7 -5.75,-0.8; 8 -5.75,-1.6; 9 -5.75,-2.4; 10 -5.75,-3.2; 11 -5.75,-4; 23 5.75,-4; 24 5.75,-3.2; 25 5.75,-2.4; 26 5.75,-1.6; 27 5.75,-0.8; 28 5.75,0; 29 5.75,0.8; 30 5.75,1.6; 31 5.75,2.4; 32 5.75,3.2; 33 5.75,4 | smd 0.55 x 1.55: 12 -4,-5.75; 13 -3.2,-5.75; 14 -2.4,-5.75; 15 -1.6,-5.75; 16 -0.8,-5.75; 17 0,-5.75; 18 0.8,-5.75; 19 1.6,-5.75; 20 2.4,-5.75; 21 3.2,-5.75; 22 4,-5.75; 34 4,5.75; 35 3.2,5.75; 36 2.4,5.75; 37 1.6,5.75; 38 0.8,5.75; 39 0,5.75; 40 -0.8,5.75; 41 -1.6,5.75; 42 -2.4,5.75; 43 -3.2,5.75; 44 -4,5.75
SOT23-5 = smd 0.55 x 1.2: 1 -0.95,-1.3; 2 0,-1.3; 3 0.95,-1.3; 4 0.95,1.3; 5 -0.95,1.3
BNC_RA = drill 0.9 pad 1.27: 1 0,-5.08; 2 -2.54,-5.08 | drill 2: P$1 -5.08,0; P$2 5.08,0
7395-03 = drill 1.016 long: 1 2.54,0; 2 0,0; 3 -2.54,0
DC_POWER_INPUT_2.1MM = drill 3.5: P1 8.5,0 | drill 3: P2 2.5,0; P3 5.55,-4.9
JP2 = drill 0.914 long: 1 -2.54,0; 2 0,0; 3 2.54,0
R0805 = smd 1.3 x 1.5: 1 -0.95,0; 2 0.95,0
OSCILLATOR_3.2X2.5 = smd 0.9 x 1.1: P$1 -1.05,-1; P$2 1.05,-1; P$3 1.05,1; P$4 -1.05,1
MA03-2 = drill 1.016: 1 -2.54,-1.27 | drill 1.016 octagon: 2 -2.54,1.27; 3 0,-1.27; 4 0,1.27; 5 2.54,-1.27; 6 2.54,1.27
R0402 = smd 0.7 x 0.9: 1 -0.65,0; 2 0.65,0
LED_HAND = smd 1.2 x 0.8: A -1,0; K 1,0
LED_PIPE_7513D2-L = hole 1.93: -1.486,0; 1.486,0
240-0002-1 = smd 0.5 x 2: P$1 -1.6,8.65; P$2 -0.8,8.65; P$3 0,8.65; P$4 0.8,8.65; P$5 1.6,8.65 | drill 1.5: SHIELD_1 -3.65,3.1; SHIELD_2 3.65,3.1; SHIELD_3 3.65,8.4; SHIELD_4 -3.65,8.4 | hole 1: -1.75,6.4; 1.75,6.4
CON_3.5MM_1X8 = drill 1.2 octagon: P1 -12.25,0; P2 -8.75,0; P3 -5.25,0; P4 -1.75,0; P5 1.75,0; P6 5.25,0; P7 8.75,0; P8 12.25,0
CON_3.5MM_1X2 = drill 1.2 octagon: P1 -1.75,0; P2 1.75,0
CON_3.5MM_1X3 = drill 1.2 octagon: P1 -3.5,0; P2 0,0; P3 3.5,0

### Placement (x,y rotation side)
C1  10.48,77.13 180 top
C2  21,65.05 90 top
C3  16.5,79.42 90 top
C4  11.92,51.93 90 top
C5  21.05,79.4 90 top
C6  24.22,46.89 0 top
C7  15.71,45.95 180 top
C8  28.05,54.59 0 top
C9  38.3,76.7 90 top
C10  14.21,40.98 270 top
C11  42.5,76.7 90 top
C12  9.09,41.65 0 top
C13  15.08,43.56 180 top
C14  49.75,77.2 270 top
C15  29.28,38.35 0 top
C16  61.25,77.2 270 top
C17  29.33,50.8 90 top
C18  36.86,31.11 270 top
C19  34.16,38.42 180 top
C20  42.49,31.99 270 top
C21  40.88,49.05 90 top
C22  50.43,43.68 90 top
C23  20.15,30 90 top
C24  75.2,10.3 180 bottom
C25  75.22,11.9 180 bottom
C26  49.48,15 270 top
C27  54.38,14.97 270 top
C28  59.27,15.05 270 top
C29  64.08,14.97 270 top
C30  68.95,15 270 top
C31  57.87,31 270 top
C32  82.47,47 0 top
C33  74.12,17.42 90 top
C34  43.24,60.09 90 top
C35  49.5,68.69 0 top
C36  54.32,53.07 0 top
C37  59.89,60.93 0 top
C38  37,62.92 90 top
C39  60.67,55.27 0 top
C40  83.28,65.35 0 top
C41  74.12,52.92 90 top
C42  71.35,42.39 270 top
C43  62.42,48.48 0 top
C44  64.05,32.9 0 top
C45  55.36,37.55 270 top
C46  55.2,43.55 90 top
CLKIN  5.96,30.41 0 top
CTUNE  33.75,72.9 270 bottom
CUSB  7.88,54.27 180 top
IC1  17.44,48.41 270 top
IC2  29,76.55 270 top
IC3  26.27,51.29 180 top
IC4  22.45,40.64 90 top
IC5  42.5,40.64 180 top
IC6  21.1,26.07 0 top
IC7  48.52,19.05 180 top
IC8  53.42,19.05 180 top
IC9  58.33,19.05 180 top
IC10  63.12,19.05 180 top
IC11  68,19.05 180 top
IC12  78.47,46.05 270 top
IC13  63.38,40.64 180 top
IC14  79.75,64.42 270 top
IC15  51.25,60.92 270 top
IN1  18.5,11.3 180 top
J1  81.8,17 90 top
J2  81.8,53.67 90 top
JACK  5.19,66.63 0 top
JP1  65.97,25.55 0 top
L1  21.48,51.77 270 top
L2  78.25,11.85 270 bottom
OSC  39.81,30.79 0 top
OSC1  60.7,30.66 0 top
OSC2  61.07,58.28 90 top
OUT1  35.5,11.3 180 top
PDI  36.3,24.69 0 top
PDI1  52.35,29.75 0 top
PDI2  67.25,64.42 0 top
R1  31.5,79.05 270 bottom
R2  10.5,36.57 180 top
R3  10.48,38.82 180 top
R4  21.68,22.02 180 top
R5  17.88,22.02 0 top
R6  7.44,20.27 0 top
R7  22.7,29.22 0 top
R8  47.55,15.02 270 top
R9  52.48,14.97 270 top
R10  57.38,15.07 270 top
R11  62.17,15 270 top
R12  67.05,14.97 270 top
R13  82.53,45.12 180 top
R14  84.75,63.45 180 top
RTRIM  31.6,71.35 90 bottom
RTUNE  31.6,74.45 90 bottom
RUSB  3.87,54.25 0 top
RX  14.53,38.82 0 top
STATE  7.21,15.56 270 top
TX  14.53,36.57 0 top
U$1  [LED_PIPE_7513D2-L]  7.21,10.16 90 top
U$3  [LOGO_5]  57.18,43.77 0 bottom
U$9  [LOGO_6]  69.2,75.67 0 top
USB  0.13,48 270 top
X1  58.2,8.07 180 top
X2  76.5,8.05 180 top
X3  79,35.92 270 top
X4  79,72.3 270 top

### Tracks (layer width: path | path; a pad name or v marks a point on that pad's centre or on a via)
5V_RAW  (via drill 0.35 pad 0.65)
  Top 0.254: IC3.3 v24.27,52.7 v24.26,52.69 | v28.2,52.69 27.22,52.69 IC3.1
  Top 0.305: 16.31,41.61 C10.1 | v20.78,41.6 IC4.20 | R2.2 9.83,36.6 R3.2 9.84,38.84 9.84,41.5 9.7,41.64 10.56,41.64 C12.+ | v23.43,49.11 23.43,52.12 22.85,52.7 21.49,52.7 L1.1 | IC3.1
  Top 0.406: IC4.20 16.31,41.61 10.61,41.61 C12.+ | L1.1 21.54,52.77
  Top 0.508: IC3.1 C8.1 | 27.16,54.55 C8.1 | 27.25,54.64 C8.1
  Top 0.61: C8.1 22.05,54.6 21.45,54 21.45,52.74 L1.1
  Bottom 0.254: v24.26,52.69 v28.2,52.69
  Bottom 0.305: v23.43,49.11 23.43,42.01 23.06,41.62 22.7,41.62 v20.78,41.6
+5V  (via drill 0.35 pad 0.65)
  Top 0.305: IC14.5 82.6,65.37 C40.1 v82.62,66.45 | IC12.5 C32.1 81.83,47.97 v81.75,48.05
  Top 1.524: 32.75,74.85 IC2.P4
  Bottom 0.254: RTUNE.2 29.25,75.1 IC2.P4
  Bottom 1.524: 80.4,19.55 83.22,19.55 | 80.4,56.2 83.2,56.2
  Bottom 1.778: 78.25,75.8 79.75,75.8 | 78.47,39.42 79.47,39.42
  other vias: 56.5,75.55 57.5,75.55 58.5,75.55 59.5,75.55 59.5,74.55 59.5,73.55 59.5,72.55 58.5,72.55 57.5,72.55 56.5,72.55 55.5,72.55 54.5,72.55 54.5,73.55 54.5,74.55 54.5,75.55 55.5,75.55 55.5,74.55 55.5,73.55 56.5,73.55 56.5,74.55 57.5,74.55 57.5,73.55 58.5,73.55 58.5,74.55 53.5,72.55 52.5,72.55 51.5,72.55 52.5,73.55 53.5,73.55 52.5,74.55 52.5,75.55 53.5,75.55 53.5,74.55 51.5,75.55 51.5,74.55 51.5,73.55 48,72.55 47,72.55 46,72.55 45,72.55 44,72.55 43,72.55 42,72.55 41,72.55 40,72.55 39,72.55 38,72.55 37,72.55 37,73.55 38,73.55 39,73.55 40,73.55 41,73.55 42,73.55 43,73.55 44,73.55 45,73.55 45,74.55 45,75.55 46,75.55 46,73.55 47,73.55 48,73.55 48,74.55 48,75.55 47,75.55 47,74.55 46,74.55 63,75.55 64,75.55 64,74.55 64,73.55 64,72.55 63,72.55 63,73.55 63,74.55
  pour Bottom: 83.5,10.55 83.5,0.05 72.5,0.05 72.5,71.55 36.5,71.55 36.5,83.55 83.5,83.55 83.5,80.05 87,80.05 87,10.55
  pour Top (no thermals): 31.5,76.05 64.5,76.05 64.5,71.55 31.5,71.55
+5V_F  (via drill 0.35 pad 0.65)
  Top 0.406: JP1.3 71.25,25.55 71.75,25.05 71.75,13.45 v71.9,13.3
  Bottom 0.406: v71.9,13.3 75.72,13.3 76.08,12.95 C25.2
  Bottom 0.61: L2.2 77.08,10.9 76.96,11.01 | 76.96,11.01 C25.2 | C24.2 76.25,10.3 76.96,11.01
  Bottom 0.813: L2.2 X2.P1
+12V
  Top 0.305: 27.35,78.1 27.5,78.25
  Top 1.27: IC2.P2 27.5,78.25 16.3,78.25
  Bottom 0.254: IC2.P2 31.35,78.25 R1.2
  pour Top (no thermals): 11.5,65.55 11.5,77.93 arc-90 12.62,78.78 25.41,78.78 arc-90 26.5,77.96 arc-90 25.09,76.55 23.91,76.55 arc90 22.5,75.14 22.5,66.96 arc-90 21.09,65.55
+V  (via drill 0.35 pad 0.65)
  Top 0.305: IC7.5 C26.1 | IC8.5 C27.1 55.45,15.62 | IC9.5 C28.1 60.3,15.7 | IC10.5 C29.1 65.7,15.62 | IC11.5 C30.1 69.97,15.65 v70,15.67 | v50.35,15.67 49.5,15.67
  Top 0.406: JP1.2 65.97,15.9 v65.75,15.67 65.7,15.62 | 49.5,15.67 C26.1 | 55.45,15.62 v55.38,15.67 | 60.3,15.7 v60.3,15.67
  Bottom 0.406: v50.35,15.67 v55.38,15.67 v60.3,15.67 v65.75,15.67 69.75,15.67 v70,15.67
AUX0_CTS  (via drill 0.25 pad 0.55)
  Top 0.203: IC5.20 40.1,50.45 v39.75,50.8 | IC13.21 60.17,50.52 v59.9,50.8
  Bottom 0.203: v39.75,50.8 v59.9,50.8
AUX0_RTS  (via drill 0.25 pad 0.55)
  Top 0.203: IC5.21 39.3,49.75 v39,50.05 | IC13.20 60.98,49.55 v60.98,49.8
  Bottom 0.203: v39,50.05 60.73,50.05 v60.98,49.8
AUX0_RXD  (via drill 0.25 pad 0.55)
  Top 0.203: IC5.22 38.5,49.05 v38.25,49.3 | v57.15,49.27 57.15,45.11 IC13.23
  Bottom 0.203: v38.25,49.3 57.12,49.3 v57.15,49.27
AUX0_TXD  (via drill 0.25 pad 0.55)
  Top 0.203: IC5.23 36.75,48.27 v37.09,48.61 | IC13.22 58.09,46.39 v58.08,46.4 | v50.88,46.7 50.88,48.24 v50.5,48.61
  Bottom 0.203: v37.09,48.61 v50.5,48.61 | v58.08,46.4 51.17,46.4 v50.88,46.7
AUX1_CTS  (via drill 0.25 pad 0.55)
  Top 0.203: IC5.24 35.71,43.84 35.5,44.05 35.5,57.52 v35.7,57.73 | IC15.21 43.97,57.72 v44,57.73
  Bottom 0.203: v44,57.73 36.68,57.73 v35.7,57.73
AUX1_RTS  (via drill 0.25 pad 0.55)
  Top 0.203: IC5.25 36.74,43.05 35.38,43.05 35,43.42 35,58.3 v35.22,58.52 | IC15.20 43.94,58.52 v44,58.53
  Bottom 0.203: v44,58.53 35.23,58.53 v35.22,58.52
AUX1_RXD  (via drill 0.25 pad 0.55)
  Top 0.203: IC5.26 34.81,42.24 34.38,42.67 34.38,55.35 v34.44,55.42 | v45.47,55.42 v45.48,55.42 47,55.42 IC15.23
  Bottom 0.203: v45.47,55.42 35.7,55.42 v34.44,55.42
AUX1_TXD  (via drill 0.25 pad 0.55)
  Top 0.203: IC5.27 34.16,41.44 33.85,41.75 33.85,56.59 v34.19,56.93 | IC15.22 v44,56.92 v44,56.93
  Bottom 0.203: v44,56.93 34.88,56.93 v34.19,56.93
BNC_DI0
  Top 0.254: IC6.2 21.1,22.1 R4.2 R5.2 18.52,16.4 IN1.1
CLK_SYNC  (via drill 0.25 pad 0.55)
  Top 0.203: v14.16,33.34 CLKIN.4 | v30.88,33.55 31.12,33.8 31.12,47.8 v31.36,48.04 | IC5.12 46.5,47.82 v46.72,48.04
  Top 0.254: CLKIN.4 | v30.88,33.55 30.75,33.55
  Bottom 0.203: v30.88,33.55 14.38,33.55 v14.16,33.34 | v46.72,48.04 31.99,48.04 v31.36,48.04
DEMO_MODE0  (via drill 0.25 pad 0.55)
  Top 0.203: IC5.4 52.2,39.04 52.52,39.36 52.52,48.2 v52.8,48.47 | v65.78,48.3 IC13.14
  Bottom 0.203: v52.8,48.47 65.6,48.47 v65.78,48.3
DEMO_MODE1  (via drill 0.25 pad 0.55)
  Top 0.203: IC15.14 43.93,63.32 v44,63.33 | IC5.15 44.1,52.7 v43.75,53.05 | v41.25,63.05 41.25,53.3 v41,53.05
  Bottom 0.203: v44,63.33 41.53,63.33 v41.25,63.05 | v43.75,53.05 v41,53.05
DI0  (via drill 0.25 pad 0.55)
  Top 0.203: v26.45,22.02 R4.1
  Bottom 0.203: X1.P1 70.45,6.5 69.5,5.55 27.8,5.55 27.02,6.32 27.02,21.45 v26.45,22.02
DISABLE_LEDS0  (via drill 0.25 pad 0.55)
  Top 0.203: IC5.3 52.97,38.24 53.26,38.53 v53.26,47.56 v53.27,47.57 | v66.58,47.65 IC13.13
  Bottom 0.203: v53.27,47.57 66.5,47.57 v66.58,47.65
DISABLE_LEDS1  (via drill 0.25 pad 0.55)
  Top 0.203: IC15.13 43.96,64.12 v44,64.12 | IC5.14 44.9,53.4 v44.5,53.8 | v40.5,63.8 40.5,54.3 v40,53.8
  Bottom 0.203: v44,64.12 40.82,64.12 v40.5,63.8 | v40,53.8 v44.5,53.8
DO0
  Top 0.254: R8.2 47.55,10 47.9,9.65 49.27,9.65 49.45,9.47 X1.P7
  Bottom 0.254: OUT1.1 35.5,7.55 36.5,6.55 48.9,6.55 49.48,7.12 49.48,8.05 X1.P7
DO1
  Top 0.254: R9.2 52.48,8.55 X1.P6
DO2
  Top 0.254: R10.2 57.38,9 X1.P5
DO3
  Top 0.254: X1.P4 59.95,10 60.5,10.55 61.73,10.55 62.17,11 R11.2
DO4
  Top 0.203: 63.5,8.12 X1.P3
  Top 0.254: R12.2 67.05,11.1 66.5,10.55 63.9,10.55 63.5,10.15 63.5,8.12
DUMMY0_0  (via drill 0.25 pad 0.55)
  Top 0.203: IC13.28 56.09,40.64 v55.92,40.65 | IC5.5 51.32,39.84 51.5,40.02 51.5,40.55 v51.6,40.65
  Bottom 0.203: v55.92,40.65 v51.6,40.65
DUMMY0_1  (via drill 0.25 pad 0.55)
  Top 0.203: IC5.16 43.3,52 v43,52.3 | v51.25,52.55 IC15.28
  Bottom 0.203: v43,52.3 51,52.3 v51.25,52.55
DUMMY1_0  (via drill 0.25 pad 0.55)
  Top 0.203: IC5.6 50.41,40.64 v50.5,40.65 | v55.97,39.84 IC13.29 | IC13.29
  Bottom 0.203: v50.5,40.65 50.5,40.08 50.74,39.84 v55.97,39.84
DUMMY1_1  (via drill 0.25 pad 0.55)
  Top 0.203: IC5.17 42.5,51.3 v42.25,51.55 | IC15.29 52.05,51.85 v51.75,51.55
  Bottom 0.203: v42.25,51.55 49.5,51.55 v51.75,51.55
FT_CTS  (via drill 0.25 pad 0.55)
  Top 0.203: v28.38,42.91 IC4.11 | IC5.29 33.46,39.84 33.25,40.05 33.25,42.67 v33,42.92
  Top 0.254: 26.09,42.92 IC4.11 | 28.51,42.91 v28.38,42.91
  Top 0.305: 26.09,42.92 IC4.11
  Bottom 0.203: v33,42.92 28.39,42.92 v28.38,42.91
FT_RTS  (via drill 0.25 pad 0.55)
  Top 0.203: v24.42,37.71 IC4.3 | IC5.28 35.29,40.64 v35.25,40.67 | v32.5,40.42 v32.5,38.05
  Top 0.305: IC4.3
  Bottom 0.203: v24.42,37.71 32.16,37.71 v32.5,38.05 | v35.25,40.67 32.75,40.67 v32.5,40.42
FT_RXD  (via drill 0.25 pad 0.55)
  Top 0.203: IC4.5 27.5,39.01 v27.63,39.13 | v31.88,39.55 31.88,36.81 32.05,36.64 IC5.33
  Top 0.305: 26.12,38.98 IC4.5
  Top 0.406: 26.09,39.01 IC4.5
  Bottom 0.203: v31.88,39.55 28.05,39.55 v27.63,39.13
FT_TXD  (via drill 0.25 pad 0.55)
  Top 0.203: 26.06,36.44 IC4.1 v26.08,35.86 | v34.71,37.44 IC5.32 | IC5.32
  Bottom 0.203: v26.08,35.86 26.26,35.67 34.25,35.67 34.5,35.92 34.5,37.23 v34.71,37.44
GND  (via drill 0.35 pad 0.65)
  Top 0.305: IC1.P$2 14.44,48.41 v14.4,48.37 | IC5.30
  Top 0.813: 38.3,76.82 38.3,79.57 | 42.5,76.8 42.5,79.55
  Top 1.016: 7.7,64.35 7.7,69.35 | 5.25,66.62 10.25,66.62 | 27.85,76.57 29.85,76.57
  Top 1.524: 80.33,14.45 83.08,14.45 | 80.4,51.12 83.15,51.12 | 48.7,80.2 50.7,80.2 | 60.2,80.2 62.2,80.2
  Top 1.778: 78.25,68.8 79.75,68.8 | 78.28,32.42 79.78,32.42
  Bottom 0.406: C25.1 73.06,11.9 v73.05,11.89 | v73.05,10.32 74.43,10.32 C24.1
  Bottom 1.016: 5.25,66.62 10.25,66.62 | 7.7,64.35 7.7,69.35 | 27.85,76.57 29.85,76.57
  other vias: 18.92,46.17 5.85,54.29 5.85,53.07 11.89,53.83 26.09,46.9 13.84,45.91 13.13,43.63 15.5,40.3 5.38,42.38 5.38,40.93 5.16,20.09 29.9,37.09 29.31,52.94 30.1,54.61 7.41,26.72 33.48,37.27 27.68,41.09 54.56,62.37 17.1,36.07 11.41,26.72 10.16,14.97 15.89,22.04 23.16,24.77 19.04,24.74 20.14,31.89 42.48,30.22 41.3,28.42 36.85,29.42 50.43,45.52 40.93,51.49 55.18,45.67 55.35,35.74 65.73,32.89 57.88,29.29 61.98,28.34 62.83,30.67 71.35,40.54 64.18,49.37 62.43,55.27 61.63,60.94 63.4,59.37 56.13,53.04 51.33,68.69 43.23,61.87 36.98,64.99 48.5,14.34 53.43,14.32 58.33,14.39 63.13,14.32 68,14.34 69.95,20.42 65,20.39 60.73,20.39 55.75,20.39 50.93,20.39 46.38,20.37 20.23,82.49 21.73,82.49 23.23,80.74 18.73,80.74 14.23,80.74 15.73,82.49 17.23,82.49 8.73,79.24 8.73,74.99 6.98,77.99 6.98,76.49 51.31,63.87 50.31,57.62 47.81,62.62 39.06,39.87 40.81,37.62 44.56,38.62 43.06,43.87 64.56,44.12 59.81,40.12 61.31,37.37 65.56,39.37
  pour Bottom (rank 2): 44.11,0.05 83.5,0.05 83.5,10.55 87,10.55 87,80.05 83.5,80.05 83.5,83.55 3.5,83.55 3.5,73.55 0,73.55 0,25.05 3.5,25.05 3.5,3.55 44.11,3.55
  pour Top (rank 2): 83.5,0.05 83.5,10.55 87,10.55 87,80.05 83.5,80.05 83.5,83.55 3.5,83.55 3.5,73.55 0,73.55 0,25.05 3.5,25.05 3.5,3.55 44.11,3.55 44.11,0.05
IN0  (via drill 0.25 pad 0.55)
  Top 0.203: IC5.40 v43.3,27.82 | R7.2 v24.02,28.55
  Bottom 0.203: v43.3,27.82 43.02,27.55 30.5,27.55 29.5,28.55 25.5,28.55 v24.02,28.55
LED_DATA0  (via drill 0.25 pad 0.55)
  Top 0.203: IC13.15 64.97,48.92 v65.35,49.3 | v74.95,48.92 74.95,46.35 75.25,46.05 IC12.2
  Bottom 0.203: v65.35,49.3 74.58,49.3 v74.95,48.92
LED_DATA1  (via drill 0.25 pad 0.55)
  Top 0.203: IC15.15 43.23,62.52 42.97,62.78 42.97,67.02 42.98,67.02 v42.98,67.77 | v75.28,67.97 75.3,67.97 75.6,67.67 75.6,64.77 75.95,64.42 IC14.2
  Bottom 0.203: v75.28,67.97 43.17,67.97 v42.98,67.77
N$1
  Top 0.254: IC14.4 84.08,63.47 R14.2
N$2
  Top 0.203: IC6.4 R7.1
N$3
  Top 0.254: IC8.4 R9.1
N$4
  Top 0.254: IC7.4 47.58,15.7 R8.1
N$5
  Top 0.254: IC9.4 R10.1
N$6
  Top 0.254: IC10.4 R11.1
N$7
  Top 0.254: IC11.4 R12.1
N$12
  Bottom 0.254: RTRIM.2 33.5,72 CTUNE.2
  Bottom 0.305: IC2.P5 29.7,73.15 30.85,72 RTRIM.2
N$13
  Top 0.254: IC12.4 81.85,45.1 R13.2
N$14
  Bottom 0.254: RTUNE.1 33.38,73.8 CTUNE.1
N$16
  Bottom 0.254: IC2.P1 31.25,79.95 R1.1
N$23
  Top 0.254: R6.1 6.79,16.98 STATE.A
N$38
  Top 0.305: 16.04,43.56 C13.1
  Top 0.356: IC4.17 16.04,43.56
N$39
  Top 0.305: IC1.P$5 20.92,48.41 21.64,49.14 21.64,50.41 21.01,51.04 21.49,51.04 L1.2 | 9.66,49.54 8.83,49.55 USB.P$1 | C4.1 11.92,51.17
  Top 0.406: 21.01,51.04 11.79,51.04 | 11.79,51.04 11.16,51.04 9.66,49.54 | 11.92,51.17 11.79,51.04
N$40
  Top 0.254: IC1.P$1 14.39,49.36 13.92,48.89 8.87,48.89
  Top 0.305: 8.81,48.83 USB.P$2 8.87,48.89
N$47
  Top 0.305: RX.A R3.1
N$48
  Top 0.305: IC4.23 17.89,39.66 17.58,39.36 17.58,38.09 16.05,36.56 15.54,36.56 TX.K
N$49
  Top 0.305: IC4.22 17.52,40.31 16.82,39.61 16.82,39.36 16.31,38.85 15.55,38.85 RX.K
N$50
  Top 0.254: IC1.P$3 14.35,47.46 13.82,47.99 8.8,47.99
  Top 0.305: 8.81,47.98 USB.P$3 8.8,47.99
N$59
  Top 0.305: 8.51,51.68 USB.SHIELD_4
  Top 0.406: CUSB.1 8.51,51.68
N$61
  Top 0.305: 3.22,51.67 USB.SHIELD_1
  Top 0.406: RUSB.1 3.22,51.67
N$62
  Top 0.305: TX.A R2.1
OSC1
  Top 0.305: IC13.37 61.77,31.69 OSC1.P$3
OSC2
  Top 0.305: IC5.37 40.9,31.83 OSC.P$3
OSC3
  Top 0.305: OSC2.P$3 IC15.37
OUT0
  Top 0.203: IC5.41 44.1,21.8 44.5,21.4 48.27,21.4 48.52,21.15 IC7.2
OUT1  (via drill 0.25 pad 0.55)
  Top 0.203: IC5.42 44.9,22.67 v45.3,22.27 | IC8.2 53.42,21.97 v53.12,22.27
  Bottom 0.203: v53.12,22.27 47.5,22.27 v45.3,22.27
OUT2  (via drill 0.25 pad 0.55)
  Top 0.203: IC5.43 45.7,23.35 v46.08,22.97 | IC9.2 58.33,22.72 v58.08,22.97
  Bottom 0.203: v58.08,22.97 47.5,22.97 47.08,22.97 v46.08,22.97
OUT3  (via drill 0.25 pad 0.55)
  Top 0.203: IC5.44 46.5,24.15 v46.88,23.77 | IC10.2 63.12,22.67 v62.8,23
  Bottom 0.203: v62.8,23 61.05,23 60.27,23.77 48.5,23.77 47.77,23.77 v46.88,23.77
OUT4  (via drill 0.25 pad 0.55)
  Top 0.203: IC5.1 v48.25,24.67 | IC11.2 68,23.42 v67.8,23.62
  Bottom 0.203: v67.8,23.62 61.6,23.62 60.7,24.52 48.4,24.52 v48.25,24.67
PDI-CLK  (via drill 0.25 pad 0.55)
  Top 0.203: IC5.35 39.3,33.57 v39.08,33.35 | PDI.5 38.85,24.35 38.52,24.67 35.3,24.67 35.02,24.95 35.02,32.55 v35.02,33.22
  Bottom 0.203: v39.08,33.35 35.15,33.35 v35.02,33.22
PDI-CLK0  (via drill 0.25 pad 0.55)
  Top 0.203: v60.17,33.27 IC13.35 | PDI1.5 54,28.47 53.75,28.72 53.75,32.8 v54,33.05
  Bottom 0.203: v54,33.05 59.95,33.05 v60.17,33.27
PDI-CLK1  (via drill 0.25 pad 0.55)
  Top 0.203: IC15.35 58.33,57.72 58.5,57.55 58.5,52.57 v58.83,52.25 | v69.8,52.55 PDI2.5
  Bottom 0.203: v58.83,52.25 69.5,52.25 v69.8,52.55
PDI-DATA  (via drill 0.25 pad 0.55)
  Top 0.203: PDI.1 32.91,23.42 32.52,23.8 32.52,26.57 33,27.05 v33,33.57 | 38.5,34.62 IC5.34 v37.65,34.04 v37.65,34.02
  Bottom 0.203: v37.65,34.02 33.45,34.02 v33,33.57
PDI-DATA0  (via drill 0.25 pad 0.55)
  Top 0.203: IC13.34 59.38,34.1 v58.98,33.7 | v51.12,33.37 51.12,28.87 50.73,28.47 PDI1.1
  Bottom 0.203: v58.98,33.7 51.45,33.7 v51.12,33.37
PDI-DATA1  (via drill 0.25 pad 0.55)
  Top 0.203: IC15.34 57,53.42 v57.4,53.02 | v64.7,53.45 PDI2.1
  Bottom 0.203: v57.4,53.02 64.28,53.02 v64.7,53.45
SERIAL_LED0
  Top 0.254: J1.2 83.95,17 84.5,17.55 84.5,35.55 | 84.5,35.55 84.5,44.8 84.17,45.12 R13.1 | X3.P2 84.12,35.92 84.5,35.55
SERIAL_LED1
  Top 0.254: R14.1 86.35,63.45 86.45,63.55 | 86.45,63.55 86.45,71.87 86.03,72.3 X4.P2 | 86.45,63.55 86.45,54 86.15,53.7 81.83,53.7 J2.2
STATE  (via drill 0.25 pad 0.55, 0.35 pad 0.65)
  Top 0.254: v10.25,32.55 9.78,32.08 9.78,20.54 9.5,20.27 R6.2 | IC5.36 40.1,35.82 39.88,36.05 32.25,36.05 32,35.8 32,32.92 31.62,32.55 v31.5,32.55
  Bottom 0.254: v10.25,32.55 v31.5,32.55
UPDATE_LEDS0  (via drill 0.25 pad 0.55)
  Top 0.203: IC5.2 53.79,37.44 54.08,37.72 54.08,51.42 54.25,51.6 v54.55,51.6 | IC13.12 67.38,51.27 v67.05,51.6
  Bottom 0.203: v67.05,51.6 v54.55,51.6
UPDATE_LEDS1  (via drill 0.25 pad 0.55)
  Top 0.203: IC15.12 43.89,64.92 v44,64.93 | IC5.13 45.7,54.1 v45.25,54.55 | v39.5,64.55 39.5,55.05 v39,54.55
  Bottom 0.203: v44,64.93 39.88,64.93 v39.5,64.55 | v45.25,54.55 v39,54.55
USBDM
  Top 0.254: IC1.P$6 17.71,49.36 17.4,49.05 17.4,45.96 | 18.77,44.27 17.88,44.27 17.4,44.75 17.4,45.96 | C7.1 17.39,45.95 17.4,45.96
  Top 0.305: 18.77,44.27 IC4.16
USBDP
  Top 0.254: IC1.P$4 21.72,47.46 22.28,46.9 | 22.28,46.87 22.28,45.74 21.4,44.87 IC4.15 | C6.1 22.29,46.89
  Top 0.305: IC4.15 | 22.28,46.9 22.28,46.87 22.29,46.89
VCCIO  (via drill 0.25 pad 0.55, 0.35 pad 0.65)
  Top 0.203: C15.1 28.63,38.54 28.62,38.55 | 43.35,59.33 C34.1 | C17.1 29.41,49.95 29.81,49.55
  Top 0.305: 28.81,49.89 C17.1 | C19.1 35.14,38.24 IC5.31 39.11,38.24 v42.5,41.62 | 42.5,41.42 v42.5,41.62 | v42.5,41.62 42.5,41.42 IC5.39 C20.1 | C42.1 IC13.9 | IC13.9 | C44.1 63.38,32.52 IC13.39 63.38,40.64 63.38,40.65 v63.38,41.64 | C45.1 55.4,38.24 IC13.31 59.98,38.24 v63.38,41.64 | C43.1 IC13.19 61.77,43.24 v63.38,41.64 | C35.1 IC15.9 48.85,63.32 v51.25,60.92 | C36.1 53.65,53.13 IC15.31 53.65,58.52 v51.25,60.92 | C37.1 IC15.39 v51.25,60.92 | C22.1 50.66,43.04 IC5.9 43.91,43.04 v42.5,41.62 | OSC1.P$4 C31.1 57.87,34.52 v57.5,34.89 | 60.07,55.32 C39.1 | C21.1 40.9,48.37 IC5.19 40.9,43.22 v42.5,41.62 | 43.35,59.33 IC15.19 49.65,59.32 v51.25,60.92 | IC13.9 64.78,43.04 v63.38,41.64 | OSC.P$4 36.89,31.79 | 36.89,31.79 C18.1 | v18.5,34.89 18.5,29.75 18.9,29.35 C23.1 IC6.5 | PDI.2 33.76,34.63 v33.5,34.89 | 36.89,31.79 36.89,34.5 v36.5,34.89 | PDI1.2 49.81,34.58 v49.5,34.89 | C46.1 55.2,41.84 v55,41.64 | C38.1 37,61.42 v36.5,60.92 | PDI2.2 56.02,65.69 v51.25,60.92 | 60.07,55.32 v59.28,55.32 v59.27,55.32 | 60.07,55.32 OSC2.P$4
  Top 0.356: IC4.4 28.62,38.36
  Top 0.406: CLKIN.1 6.76,34.22 9.83,34.22 v10.51,34.89 | 28.62,38.36 28.62,38.55 | 29.14,49.9 C17.1 | 29.81,49.84 29.75,49.9 | v28.88,42.05 | v28.88,42.05 28.84,42.08 | v56.75,25.8 56.75,34.64 v56.5,34.89
  Top 0.61: C15.1 28.63,35.01 28.75,34.89 v29.16,34.89 | IC3.5 28.81,49.89 | 29.81,49.84 29.81,49.55 29.81,43.05 28.84,42.08 28.62,41.85 28.62,38.55 | 29.14,49.9 32.6,49.9 32.8,50.1 32.8,60.65 v33.08,60.92
  Bottom 0.203: v42.5,41.62 42.5,41.64
  Bottom 0.305: v59.27,55.32 56.85,55.32 v51.25,60.92
  Bottom 0.406: v10.51,34.89 v18.5,34.89 v29.16,34.89 | 29,41.92 v28.88,42.05 | JP1.1 57,25.55 v56.75,25.8
  Bottom 0.61: v63.38,41.64 v55,41.64 42.5,41.64 29.29,41.64 v28.88,42.05 | v51.25,60.92 v36.5,60.92 v33.08,60.92 | v29.16,34.89 v33.5,34.89 v36.5,34.89 v49.5,34.89 54.5,34.89 v56.5,34.89 v57.5,34.89

### Text on the board
tPlace: Licensed under the TAPR Open / Hardware License (www.tapr.org/OHL) / / Copyright 2018 Artur Silva and Filipe Carvalho | harp RGB v1.0 | 5V | S | G | Licensed under the TAPR Open Hardware / License (www.tapr.org/OHL) | 12V / Only! | RGB / LED1 | Hardware Platform | 5V | www.cf-hw.org | S | G | 5V | S | G | output | voltage | selector | 3V | 5V | RGB / LED0 | DI0 | DO0 | 5V | S | G | GND | DO0 | DO1 | DO2 | DO3 | DO4 | GND | DI0 | GND | +5V